# Altium schematic sheet UCC27444_GateDrivers.SchDoc
size A4; SheetNumber: 7; SheetTotal: 8
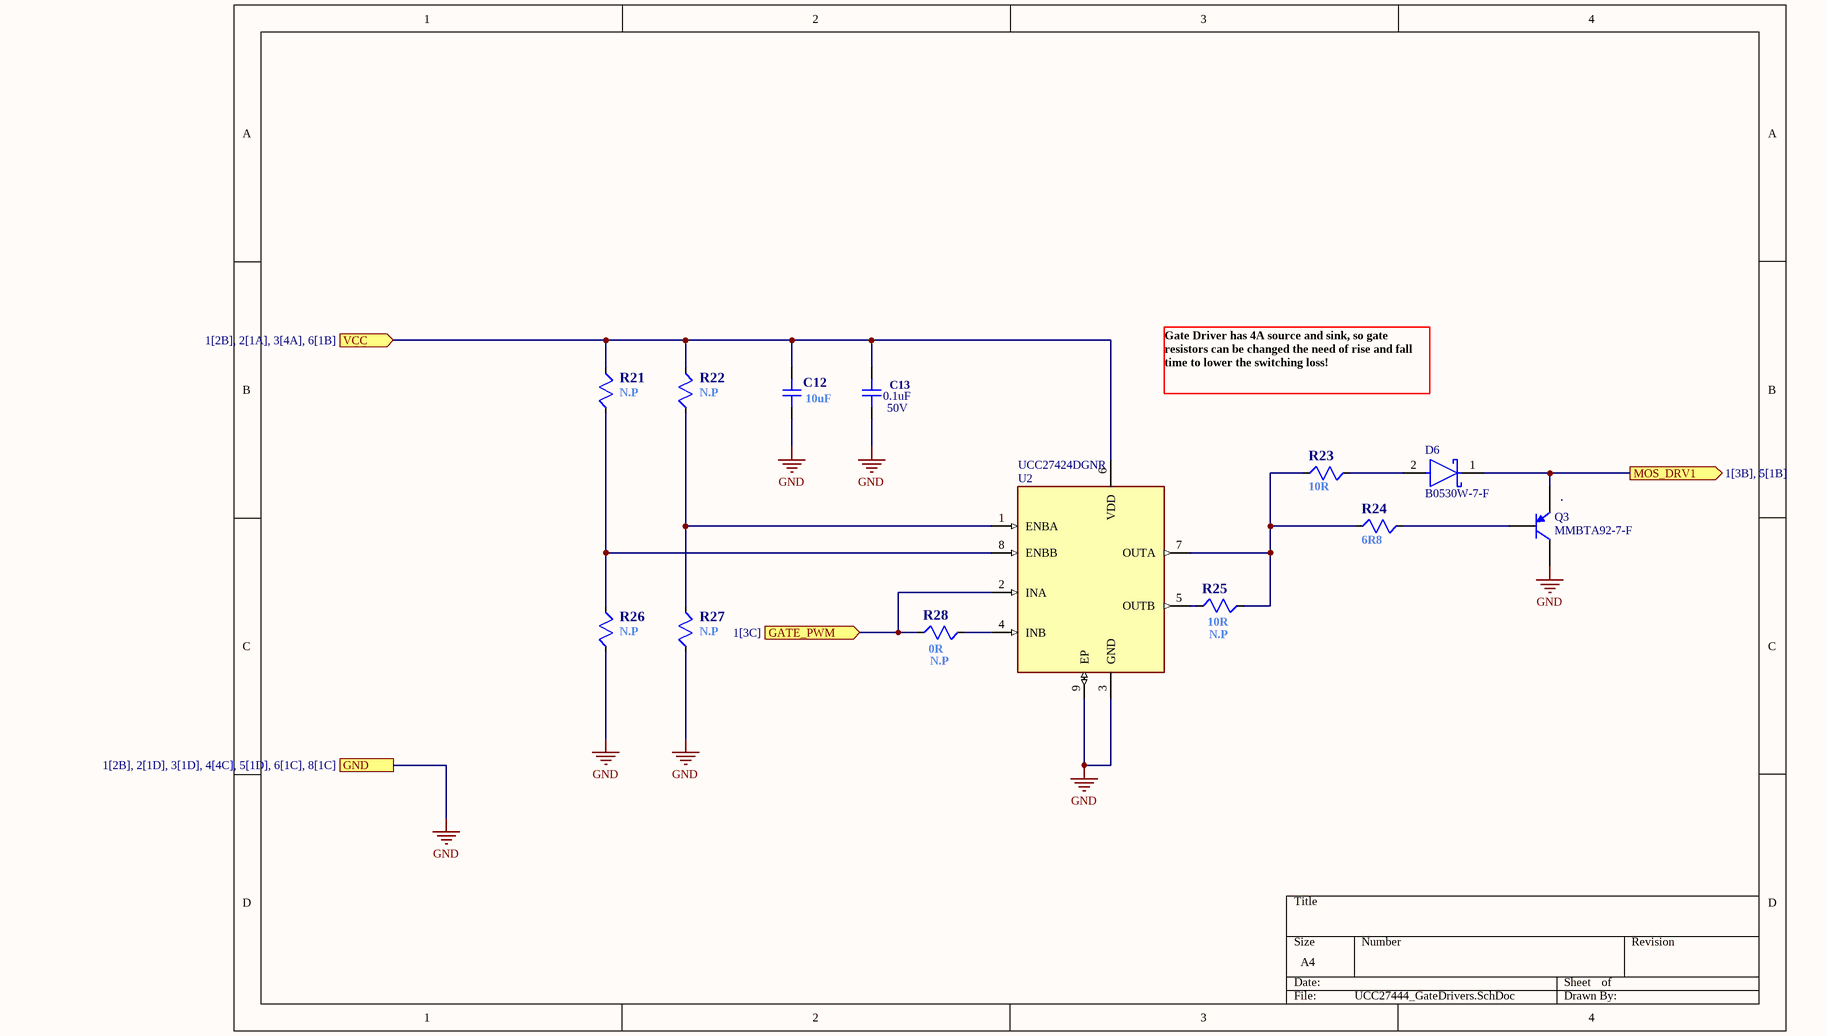
[diagram p0: UCC27444_GateDrivers.SchDoc]

## Parts
C12  value 10uF  [CAP_0805]  (hidden comment: CL21A106KAYNNNE)
C13  value 0.1uF  Rating: 50V  [CAPC1608N]  (hidden comment: CL10B104KB8NNNC)
D6  B0530W-7-F  [FP-SOD123-MFG]
Q3  MMBTA92-7-F  [DIOD-SOT23-3_V]
R21  N.P  [RESC1608N]
R22  N.P  [RESC1608N]
R23  value 10R  [RESC1608N]  (hidden comment: 0603SAJ0100T5E)
R24  value 6R8  [RESC1608N]  (hidden comment: 0603SAJ068JT5E)
R25  N.P  value 10R  [RESC1608N]
R26  N.P  [RESC1608N]
R27  N.P  [RESC1608N]
R28  N.P  value 0R  [RESC1608N]
U2  UCC27424DGNR  [SOP65P490X110-9N]

## Ports
GATE_PWM (in, see 1[3C]), GND (see 1[2B], 2[1D], 3[1D], 4[4C], 5[1D], 6[1C], 8[1C]), MOS_DRV1 (out, see 1[3B], 5[1B]), VCC (in, see 1[2B], 2[1A], 3[4A], 6[1B])

## Nets
GND: C12.1 C13.1 Q3.3(C) R26.2 R27.2 U2.3(GND) U2.9(EP) ; port GND
GATE_PWM: R28.2 U2.2(INA) ; port GATE_PWM
MOS_DRV1: D6.1(C) Q3.2(E) ; port MOS_DRV1
VCC: C12.2 C13.2 R21.1 R22.1 U2.6(VDD) ; port VCC
NetD6_2: D6.2(A) R23.1
NetQ3_1: Q3.1(B) R24.1
NetR21_2: R21.2 R26.1 U2.8(ENBB)
NetR22_2: R22.2 R27.1 U2.1(ENBA)
NetR23_2: R23.2 R24.2 R25.1 U2.7(OUTA)
NetR25_2: R25.2 U2.5(OUTB)
NetR28_1: R28.1 U2.4(INB)

## Notes on the sheet
- Gate Driver has 4A source and sink, so gate resistors can be changed the need of rise and fall time to lower the switching loss!

## Library data of the parts
C12 = CAP_0805: MLCC (2012) 0805 10uF 25VDC ±10% X5R; Manufacturer: YAGEO; Manufacturer Part Number: CC0805KKX7R9BB105; Rating: 50V; Distributor Link: https://www.digikey.com/en/products/detail/yageo/CC0805KKX7R9BB105/5195292; LCSC: X7R; Dielectric: *
C13 = CAP_0805: MLCC (1608) 0603 100nF 50VDC ±10% X7R; Manufacturer: *; Manufacturer Part Number: *; Distributor Link: *; LCSC: *
D6 = CMP-2000-05879-2: DIODE SCHOTTKY 30V 500MA SOD123; Manufacturer: Diodes Inc.; Max Surge Forward Current: 5.5A; Forward Current: 0.5A; Max Junction Temp: +125°C; Standoff Height: 0mm; Capacitance: 170pF; Value: 170pF; Peak Reverse Current: 130uA; Footprint Url: https://www.diodes.com/assets/Package-Files/SOD123.pdf; Device Class L1: Discrete Semiconductors; ComponentLink2Description: Datasheet; Mouser Description: Schottky Diodes & Rectifiers 30V 410mW; Device Class L3: Schottky Diodes; Package: SOD123; Temperature: -65°C to +125°C; Temperature Range Low: -65°C; Lead Free: Yes; Digikey Description: DIODE SCHOTTKY 30V 500MA SOD123; Ipc Land Pattern Name: SOD365155X123-2; Automotive: No; Octopart: https://octopart.com/b0530w-7-f-diodes+inc.-325721; Device Class L2: Diodes; ComponentLink2URL: https://www.diodes.com/assets/Datasheets/ds30139.pdf; RoHS: TRUE; Height: 1.45mm; Max Repetitive Reverse Voltage: 30V; Category: Diode; Temperature Range High: +125°C; Manufacturer Part Number: B0530W-7-F; Reverse Voltage: 30V
Q3 = CMP-2000-06736-1: PNP Small Signal Transisitor, 500 mA, 300 mW, -55 to 150 degC, 3-Pin SOT23, RoHS, Tape and Reel; DC Collector/Base Gain hfe Min: 40; Brand: DiodesIncorporated; Maximum DC Collector Current: 0.5A; Collector- Base Voltage VCBO: -300V; Pd - Power Dissipation: 300mW; Unit Weight: 0.000282oz; Configuration: Single; Emitter- Base Voltage VEBO: -5V; Continuous Collector Current: -0.2A; Gain Bandwidth Product fT: 50MHz; Collector-Emitter Saturation Voltage: -0.5V; Minimum Operating Temperature: -55C; Transistor Polarity: PNP; Manufacturer URL: http://www.diodes.com/; Mounting Style: SMD/SMT; Height: 1mm; Product Category: BipolarTransistors-BJT; Package / Case: SOT-23; Package Description: 3-Pin Small Outline Transistor, Body 2.9 x 1.3 mm, Pitch 0.96 mm; Mounting Technology: SurfaceMount; Manufacturer: DiodesIncorporated; Collector- Emitter Voltage VCEO Max: -300V; Series: MMBTA92; Maximum Operating Temperature: +150C; Length: 3.05mm; Width: 1.4mm; Factory Pack Quantity: 3000; Datasheet URL: http://www.diodes.com/_files/datasheets/ds30060.pdf; Package Reference: SOT23-3; Packaging: Reel; RoHS: True; Datasheet Version: Rev. 12-2, 05/2015
R21 R22 R26 R27 = RES: 0.1W, 1/10W Chip Resistor 0603 (1608 Metric); Value: N.P
R23 R25 R28 = RES: RES.(1608) 0603 10 Ohms 5% 1/10W-S 400PPM
R24 = RES: RES.(1608) 0603 6.8 Ohms 5% 1/10W-S 400PPM
U2 = UCC27424DGNR: Dual Low-Side Gate Driver IC Non-Inverting 8-HVSSOP; MF: {'manufacturer': u'Texas Instruments'}; Package: None; Price: None; Value: *; MP: UCC27424DGNR; Availability: Unavailable